# EAGLE schematic VentillatorCircuit (EAGLE 9.6.1)
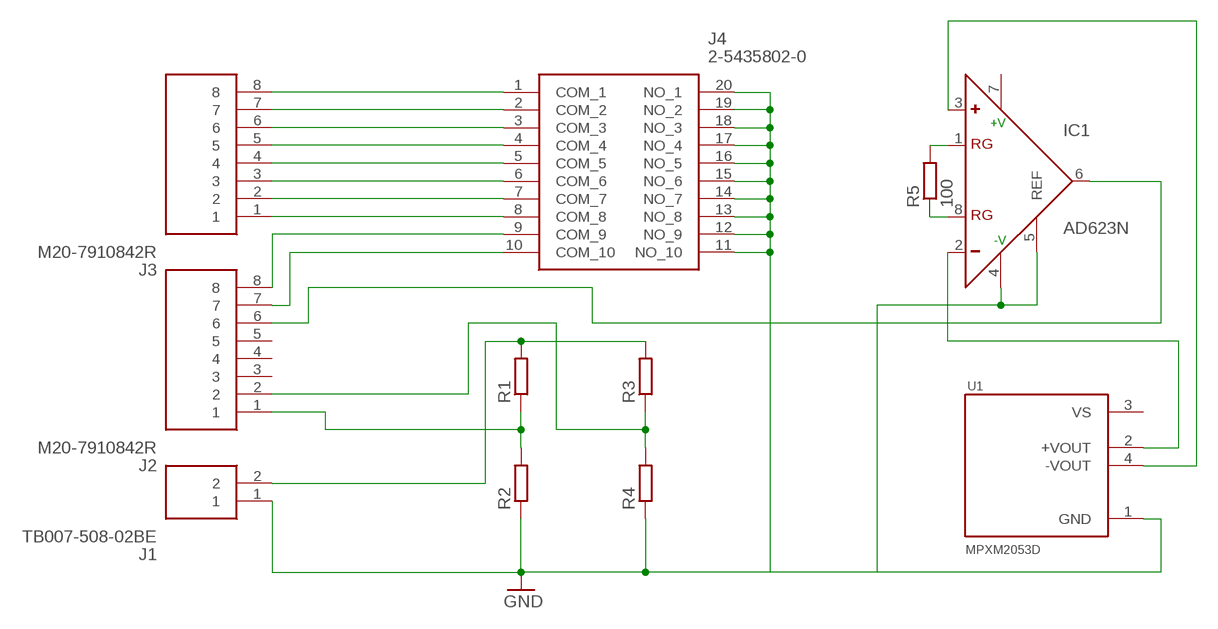
[diagram p0: schematic, sheet 1]

## Parts
IC1  AD623N  [DIL08]
J1  TB007-508-02BE  [TB00750802BE]
J2  M20-7910842R  [M207910842R]
J3  M20-7910842R  [M207910842R]
J4  2-5435802-0  [254358020]
R1  R-EU_0207/12  [0207/12]
R2  R-EU_0207/12  [0207/12]
R3  R-EU_0207/12  [0207/12]
R4  R-EU_0207/12  [0207/12]
R5  100  R-EU_0207/12  [0207/12]
U1  MPXM2053D  [SOT127P1219X419-5N]

## Nets
GND: IC1.4(-V) IC1.5(REF) J1.1 J4.11(NO_10) J4.12(NO_9) J4.13(NO_8) J4.14(NO_7) J4.15(NO_6) J4.16(NO_5) J4.17(NO_4) J4.18(NO_3) J4.19(NO_2) J4.20(NO_1) R2.1 R4.1 U1.1(GND)
N$1: J3.8 J4.1(COM_1)
N$2: J3.7 J4.2(COM_2)
N$3: J3.6 J4.3(COM_3)
N$4: J3.5 J4.4(COM_4)
N$5: J3.4 J4.5(COM_5)
N$6: J3.3 J4.6(COM_6)
N$7: J3.2 J4.7(COM_7)
N$8: J3.1 J4.8(COM_8)
N$9: J2.8 J4.9(COM_9)
N$10: J2.7 J4.10(COM_10)
N$11: J2.1 R1.1 R2.2
N$12: J2.2 R3.1 R4.2
N$13: IC1.1(RG) R5.2
N$14: IC1.8(RG) R5.1
N$15: J1.2 R1.2 R3.2
N$16: IC1.3(+) U1.4(-VOUT)
N$17: IC1.2(-) U1.2(+VOUT)
N$19: IC1.6(OUT) J2.6
Unconnected: J2.3 J2.4 J2.5

## Power pins joined to a net without a drawn wire
+V: IC1.7(+V)
VS: U1.3(VS)

## Library data of the parts
IC1 = analog-devices:AD623: Single-Supply, Rail-to-Rail, Low Cost Instrumentation Amplifier Source: http://www.analog.com/static/imported-files/data_sheets/AD623.pdf; MF: ALTERA CORPORATION; MPN: AD623ANZ; OC_FARNELL: 9603700; OC_NEWARK: 59K4402
J1 = SamacSys_Parts:TB007-508-02BE: Fixed Terminal Blocks screw type, 5.08 , horizontal, 2 poles, CUI Blue, slotted screw, PCB mount Source: Datasheet; DESCRIPTION: Fixed Terminal Blocks screw type, 5.08 , horizontal, 2 poles, CUI Blue, slotted screw, PCB mount; HEIGHT: 14mm; MANUFACTURER_NAME: CUI Devices; MANUFACTURER_PART_NUMBER: TB007-508-02BE; MOUSER_PART_NUMBER: 490-TB007-508-02BE; MOUSER_PRICE-STOCK: https://www.mouser.co.uk/ProductDetail/CUI-Devices/TB007-508-02BE?qs=vLWxofP3U2y6PFKAfCqKUQ%3D%3D
J2 J3 = SamacSys_Parts:M20-7910842R: Headers & Wire Housings 8 WAY SIL HORIZ SMT SKT T&R Source: Datasheet <https://cdn.harwin.com/pdfs/M20-791R.pdf>; DESCRIPTION: Headers & Wire Housings 8 WAY SIL HORIZ SMT SKT T&R; HEIGHT: 2.65mm; MANUFACTURER_NAME: HARWIN; MANUFACTURER_PART_NUMBER: M20-7910842R; MOUSER_PART_NUMBER: 855-M20-7910842R; MOUSER_PRICE-STOCK: https://www.mouser.co.uk/ProductDetail/Harwin/M20-7910842R?qs=k41KVqW3ympJ6ZCQNkwKKw%3D%3D
J4 = SamacSys_Parts:2-5435802-0: DIP Switches / SIP Switches 10 POS SIDE ACT SLD Source: Datasheet <https://www.te.com/commerce/DocumentDelivery/DDEController?Action=srchrtrv&DocNm=5435802&DocType=Customer Drawing&DocLang=English>; DESCRIPTION: DIP Switches / SIP Switches 10 POS SIDE ACT SLD; HEIGHT: 7.874mm; MANUFACTURER_NAME: TE Connectivity; MANUFACTURER_PART_NUMBER: 2-5435802-0; MOUSER_PART_NUMBER: 506-2-5435802-0; MOUSER_PRICE-STOCK: https://www.mouser.com/Search/Refine.aspx?Keyword=506-2-5435802-0
R1-R5 = rcl:R-EU_: RESISTOR, European symbol; SPICEPREFIX: R
U1 = MPXM2053D:MPXM2053D: Pressure Sensor 7.25PSI (50kPa) Differential 0 mV ~ 40 mV (10V) 5-SMD Module; AVAILABILITY: Unavailable; DESCRIPTION: Pressure Sensor 7.25PSI _50kPa_ Differential 0 mV ~ 40 mV _10V_ 5-SMD Module; MF: Freescale Semiconductor; MP: MPXM2053D; PACKAGE: SMD-5 Freescale Semiconductor; PRICE: None